# EAGLE design rev_g (EAGLE 7.6.0)
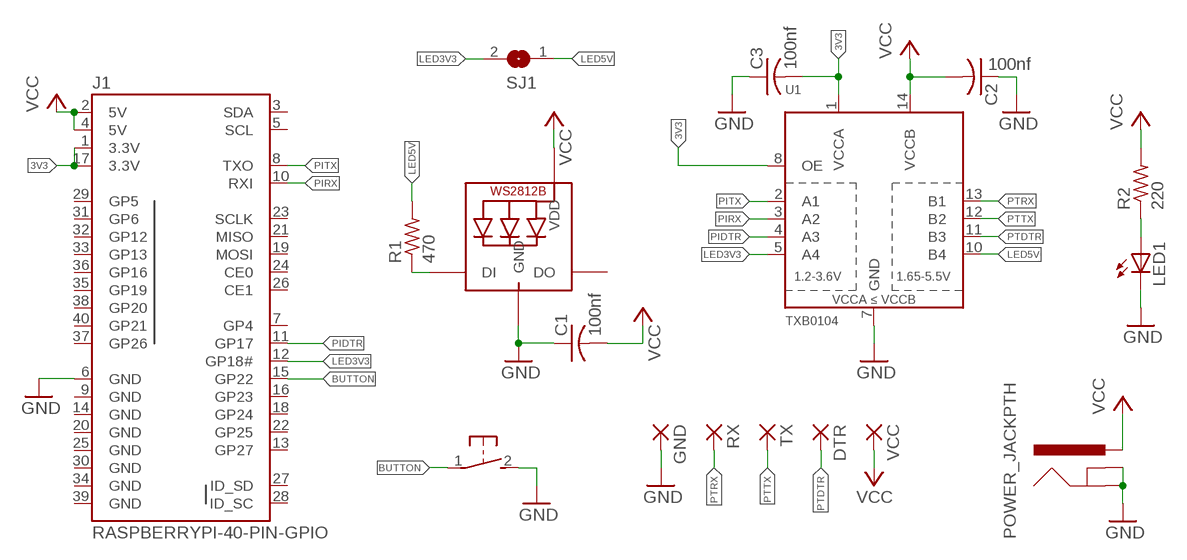
[diagram p0: schematic, sheet 1]

## Parts
C1  100nf  C-USC0805K  [C0805K]
C2  100nf  C-USC0805K  [C0805K]
C3  100nf  C-USC0805K  [C0805K]
DTR  SMD5  [SMD2,54-5,08]
GND  SMD5  [SMD2,54-5,08]
J1  RASPBERRYPI-40-PIN-GPIO  [2X20-SHROUDED]
J3  POWER_JACKPTH  [POWER_JACK_PTH]
LED1  LEDCHIPLED_0805  [CHIPLED_0805]
LED2  WS2812B5050  [WS2812B]
R1  470  R-US_M0805  [M0805]
R2  220  R-US_M0805  [M0805]
RX  SMD5  [SMD2,54-5,08]
S1  DTSM-3  [DTSM-3]
SJ1  SJ  [SJ]
TX  SMD5  [SMD2,54-5,08]
U1  TXB0104  TXB0104PWR  [TSSOP14]
VCC  SMD5  [SMD2,54-5,08]

## Nets
3V3: C3.2 J1.1(3.3V) J1.17(3.3V) U1.1(VCCA) U1.8(OE)
BUTTON: J1.15(GP22) S1.1
GND: C1.1 C2.1 C3.1 GND.1(P) J1.6(GND) J3.GND J3.GNDBREAK LED1.C LED2.3-GND(GND) S1.2 U1.7(GND)
LED3V3: J1.12(GP18#) SJ1.2 U1.5(A4)
LED5V: R1.2 SJ1.1 U1.10(B4)
N$1: LED2.4-DIN(DI) R1.1
N$2: LED1.A R2.1
PIDTR: J1.11(GP17) U1.4(A3)
PIRX: J1.10(RXI) U1.3(A2)
PITX: J1.8(TXO) U1.2(A1)
PTDTR: DTR.1(P) U1.11(B3)
PTRX: RX.1(P) U1.13(B1)
PTTX: TX.1(P) U1.12(B2)
VCC: C1.2 C2.2 J1.2(5V) J1.4(5V) J3.PWR LED2.1-VDD(VDD) R2.2 U1.14(VCCB) VCC.1(P)
Unconnected: J1.3(SDA) J1.5(SCL) J1.7(GP4) J1.13(GP27) J1.16(GP23) J1.18(GP24) J1.19(MOSI) J1.21(MISO) J1.22(GP25) J1.23(SCLK) J1.24(CE0) J1.26(CE1) J1.27(ID_SD) J1.28(ID_SC) J1.29(GP5) J1.31(GP6) J1.32(GP12) J1.33(GP13) J1.35(GP19) J1.36(GP16) J1.37(GP26) J1.38(GP20) J1.40(GP21) LED2.2-DOUT(DO)

## Power pins joined to a net without a drawn wire
GND: J1.9(GND) J1.14(GND) J1.20(GND) J1.25(GND) J1.30(GND) J1.34(GND) J1.39(GND)

## Library data of the parts
C1-C3 = rcl:C-US: CAPACITOR, American symbol
DTR GND RX TX VCC = wirepad:SMD5: SMD PAD
J1 = SparkFun-Boards:RASPBERRYPI-40-PIN-GPIO: Second Generation Raspberry Pi GPIO Header 2x20 pin connector, as found on B, B+, A+ models.
J3 = SparkFun-Connectors:POWER_JACK: Power Jack This is the standard 5.5mm barrel jack for power. The PTH is the most common, proven, reliable, footprint. The Slot footprint only works if the mill layer is transmitted to the PCB fab house so be warned. Mating wall wart : TOL-00298 (and others); PROD_ID: CONN-08197
LED1 = led:LED: LED OSRAM: - CHIPLED LG R971, LG N971, LY N971, LG Q971, LY Q971, LO R971, LY R971 LH N974, LH R974 LS Q976, LO Q976, LY Q976 LO Q996 - Hyper CHIPLED LW Q18S LB Q993, LB Q99A, LB R99A - SideLED LS A670, LO A670, LY A670, LG A670, LP A670 LB A673, LV A673, LT A673, LW A673 LH A674 LY A675 LS A676, LA A676, LO A676, LY A676, LW A676 LS A679, LY A679, LG A679 - Hyper Micro SIDELED® LS Y876, LA Y876, LO Y876, LY Y876 LT Y87S - SmartLED LW L88C, LW L88S LB L89C, LB L89S, LG L890 LS L89K, LO L89K, LY L89K LS L896, LA L896, LO L896, LY L896 - TOPLED LS T670, LO T670, LY T670, LG T670, LP T670 LSG T670, LSP T670, LSY T670, LOP T670, LYG T670 LG T671, LOG T671, LSG T671 LB T673, LV T673, LT T673, LW T673 LH T674 LS T676, LA T676, LO T676, LY T676, LB T676, LH T676, LSB T676, LW T676 LB T67C, LV T67C, LT T67C, LS T67K, LO T67K, LY T67K, LW E67C LS E67B, LA E67B, LO E67B, LY E67B, LB E67C, LV E67C, LT E67C LW T67C LS T679, LY T679, LG T679 LS T770, LO T770, LY T770, LG T770, LP T770 LB T773, LV T773, LT T773, LW T773 LH T774 LS E675, LA E675, LY E675, LS T675 LS T776, LA T776, LO T776, LY T776, LB T776 LHGB T686 LT T68C, LB T68C - Hyper Mini TOPLED® LB M676 - Mini TOPLED Santana® LG M470 LS M47K, LO M47K, LY M47K Source: http://www.osram.convergy.de LUXEON: - LUMILED® LXK2-PW12-R00, LXK2-PW12-S00, LXK2-PW14-U00, LXK2-PW14-V00 LXK2-PM12-R00, LXK2-PM12-S00, LXK2-PM14-U00 LXK2-PE12-Q00, LXK2-PE12-R00, LXK2-PE12-S00, LXK2-PE14-T00, LXK2-PE14-U00 LXK2-PB12-K00, LXK2-PB12-L00, LXK2-PB12-M00, LXK2-PB14-N00, LXK2-PB14-P00, LXK2-PB14-Q00 LXK2-PR12-L00, LXK2-PR12-M00, LXK2-PR14-Q00, LXK2-PR14-R00 LXK2-PD12-Q00, LXK2-PD12-R00, LXK2-PD12-S00 LXK2-PH12-R00, LXK2-PH12-S00 LXK2-PL12-P00, LXK2-PL12-Q00, LXK2-PL12-R00 Source: www.luxeon.com KINGBRIGHT: KA-3528ASYC Source: www.kingbright.com
LED2 = adafruit:WS2812B
R1 R2 = rcl:R-US_: RESISTOR, American symbol
S1 = switch-tact:DTSM-3
SJ1 = jumper:SJ: SMD solder JUMPER
U1 = SparkFun-DigitalIC:TXB0104PWR: 4-Bit Bi-Directional Level Shifter 1.2V-3.6V (VCCA) to 1.65V-5.5V (VCCB) bi-directional level shifter with auto direction sensing. Max data rate - VCCA 1.8V: 20Mbps (50ns), VCCA 3.3V: 100Mbps (10ns) Digikey: 296-21929-1-ND (TSSOP) IC-11329; PROD_ID: IC-11329

## Board
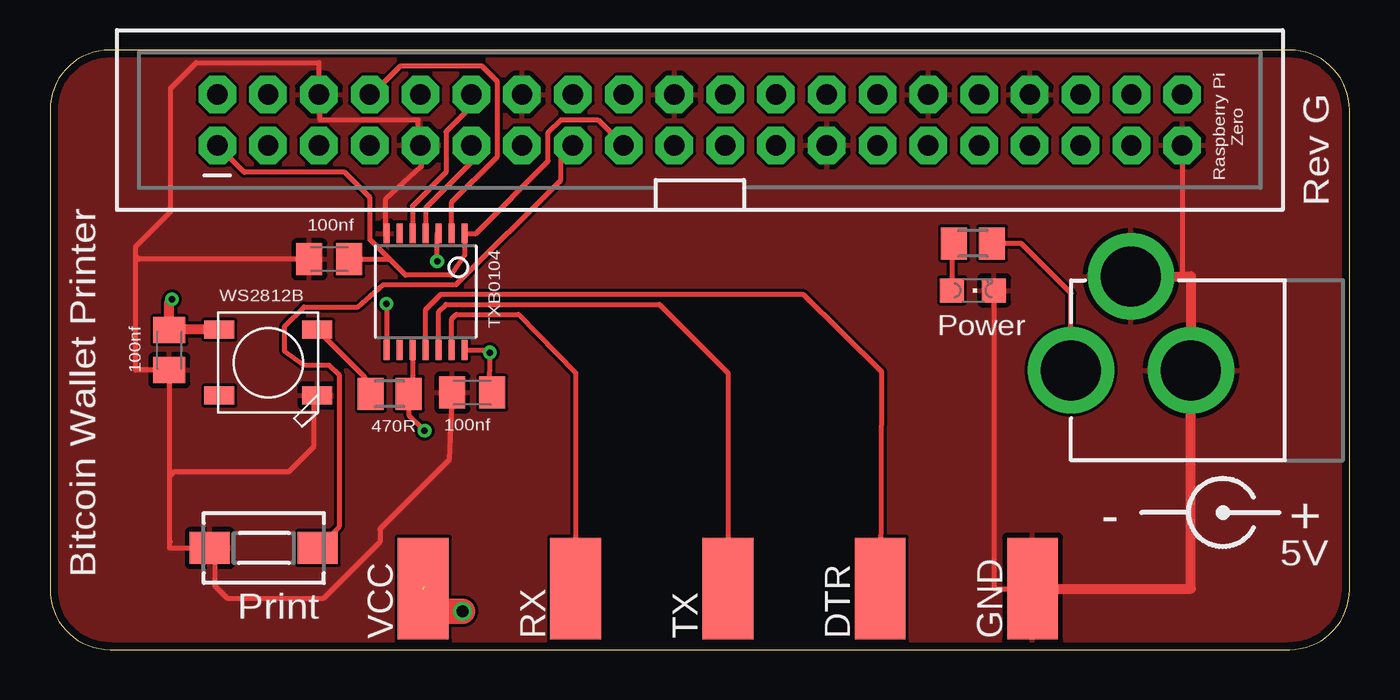
[diagram p1: board, top side]
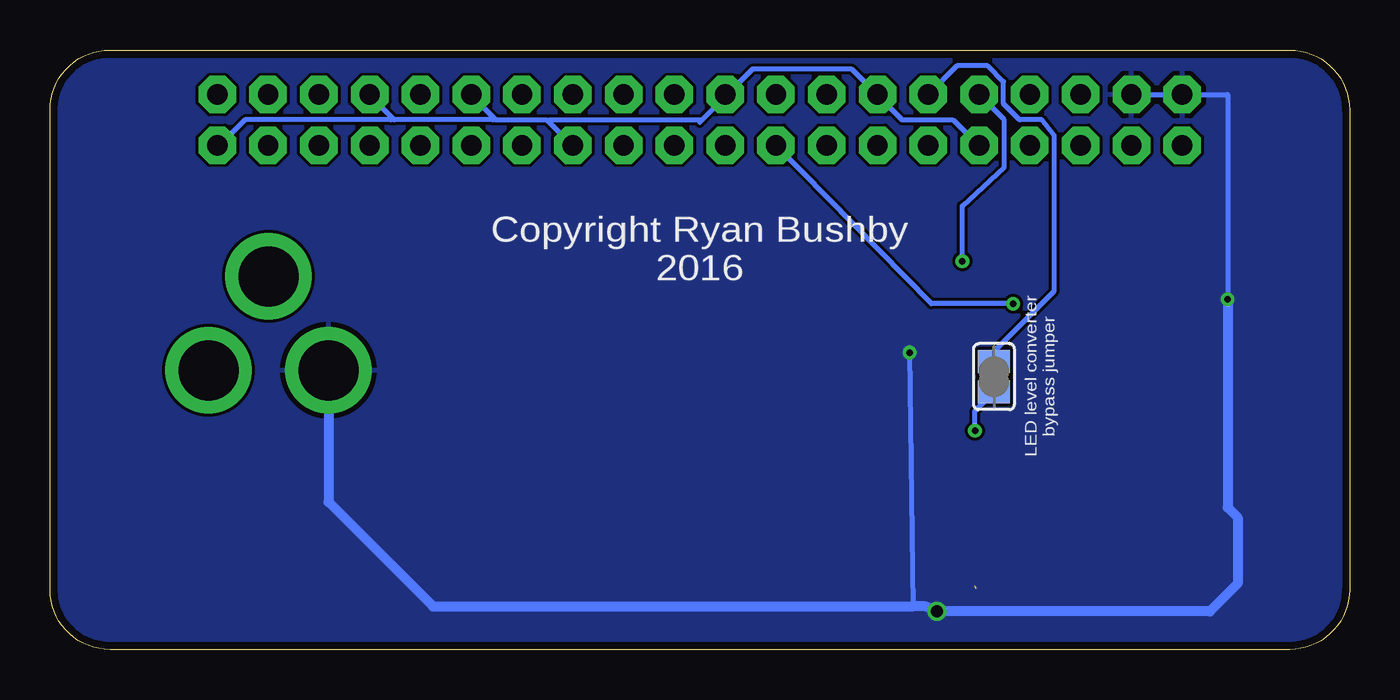
[diagram p2: board, bottom side, seen from below]

Size 65 x 30 mm. Coordinates in mm from the lower left corner, seen from the top.
Outline: 0,27 0,3 arc90 3,0 62,0 arc90 65,3 65,27 arc90 62,30 3,30 arc90 0,27
Copper layers (1*16): Top 0.0356mm / dielectric 1.5011mm / Bottom 0.0356mm
Design rules "LaenPCBOrder *": minimum track width 10mil, minimum drill 13mil, track to track 6mil, track to pad 6mil, pad to pad 6mil, via to via 6mil, smd to smd 6mil, copper to edge 15mil, drill to drill 6mil, minimum pad ring 7mil, minimum via ring 7mil, stop-mask expansion 3mil, vias tented up to drill 100mil, thermal gap 10mil

### Footprints (pad centres in the part's own frame; a part is rotated, then mirrored left to right if it is on the bottom)
C0805K = smd 1.3 x 1.6: 1 -1,0; 2 1,0
SMD2,54-5,08 = smd 2.54 x 5.08: 1 0,0
2X20-SHROUDED = drill 1.016 pad 1.88 octagon: 1 -1.27,24.13; 2 1.27,24.13; 3 -1.27,21.59; 4 1.27,21.59; 5 -1.27,19.05; 6 1.27,19.05; 7 -1.27,16.51; 8 1.27,16.51; 9 -1.27,13.97; 10 1.27,13.97; 11 -1.27,11.43; 12 1.27,11.43; 13 -1.27,8.89; 14 1.27,8.89; 15 -1.27,6.35; 16 1.27,6.35; 17 -1.27,3.81; 18 1.27,3.81; 19 -1.27,1.27; 20 1.27,1.27; 21 -1.27,-1.27; 22 1.27,-1.27; 23 -1.27,-3.81; 24 1.27,-3.81; 25 -1.27,-6.35; 26 1.27,-6.35; 27 -1.27,-8.89; 28 1.27,-8.89; 29 -1.27,-11.43; 30 1.27,-11.43; 31 -1.27,-13.97; 32 1.27,-13.97; 33 -1.27,-16.51; 34 1.27,-16.51; 35 -1.27,-19.05; 36 1.27,-19.05; 37 -1.27,-21.59; 38 1.27,-21.59; 39 -1.27,-24.13; 40 1.27,-24.13
POWER_JACK_PTH = drill 2.997 pad 4.318: GND 0,7.7; GNDBREAK 4.7,10.7; PWR 0,13.7
CHIPLED_0805 = smd 1.2 x 1.2: A 0,-1.05; C 0,1.05
WS2812B = smd 1.5 x 0.9: 1-VDD 2.45,-1.65; 2-DOUT 2.45,1.65; 3-GND -2.45,1.65; 4-DIN -2.45,-1.65
M0805 = smd 1.3 x 1.6: 1 -0.95,0; 2 0.95,0
DTSM-3 = smd 2 x 1.6: 1 -2.7,0; 2 2.7,0
SJ = smd 1.168 x 1.6: 1 -0.762,0; 2 0.762,0
TSSOP14 = smd 0.305 x 0.991: 1 -1.95,-2.918; 2 -1.3,-2.918; 3 -0.65,-2.918; 4 0,-2.918; 5 0.65,-2.918; 6 1.3,-2.918; 7 1.95,-2.918; 8 1.95,2.918; 9 1.3,2.918; 10 0.65,2.918; 11 0,2.918; 12 -0.65,2.918; 13 -1.3,2.918; 14 -1.95,2.918

### Placement (x,y rotation side)
C1  5.97,14.99 90 top
C2  21.11,12.86 0 top
C3  13.97,19.53 0 top
DTR  41.53,3.05 0 top
GND  49.15,3.05 0 top
J1  32.5,26.5 90 top
J3  64.77,13.97 90 top
LED1  46.16,17.97 270 top
LED2  10.92,14.35 180 top
R1  17,12.8 0 top
R2  46.16,20.32 0 top
RX  26.29,3.05 0 top
S1  10.69,5.08 180 top
SJ1  17.78,13.65 90 bottom
TX  33.91,3.05 0 top
U1  18.8,17.91 180 top
VCC  18.67,3.05 0 top

### Tracks (layer width: path | path; a pad name or v marks a point on that pad's centre or on a via)
3V3  (via drill 0.33)
  Top 0.254: 16.99,19.53 17.78,18.73 20.07,18.73 20.75,19.73 U1.1 21.3,20.82 24.92,24.45 24.92,25.88 25.56,26.51 27.41,26.51 J1.17 | 16.99,19.53 16,20.51 16,22.61 14.73,23.88 9.72,23.88 J1.1 | v16.83,17.3 U1.8 | C3.2 16.99,19.53
  Bottom 0.254: v16.83,17.3 20.92,17.3 J1.17
BUTTON
  Top 0.254: S1.1 14.48,6.17 14.48,13.72 13.97,14.22 12.7,14.22 11.75,14.92 11.75,16.19 12.7,17.14 15.4,17.14 16.67,18.26 20.32,18.26 25.56,23.5 25.56,24.64 J1.15 26.15,25.39
GND
  Top 0.254: 5.97,8.64 C1.1 4.29,13.99 4.29,19.68 | 5.97,8.64 5.97,5.4 | 5.97,5.4 5.97,5.08 S1.2 8.26,4.82 8.26,3.17 8.89,2.54 13.65,2.54 16.51,5.4 16.51,6.03 19.95,9.48 C2.1 | 13.34,12.7 LED2.3-GND | 6.03,5.4 5.97,5.4 | LED2.3-GND 13.18,12.38 13.18,10.13 11.94,8.89 6.22,8.89 5.97,8.64 | J1.9 18.41,25.24 18.41,26.51 13.49,26.51 13.49,27.62 J1.6 13.45,29.37 7.3,29.37 6.03,28.1 6.03,21.91 4.29,20.16 4.29,19.68 | 56.67,18.67 56.67,25.08 J1.39 | J1.9 18.57,25.08 18.57,24.16 16.76,22.51 16.76,20.91 U1.7 | 18.73,25.08 J1.9 | 13.34,13.02 LED2.3-GND | LED1.C 47.22,3.05 49.66,3.05 | C3.1 4.45,19.53 4.29,19.68
  Top 0.508: J3.GNDBREAK 56.67,18.67 57.07,18.67 J3.GND 57.07,3.05 49.66,3.05 GND.1
  Bottom 0.254: J1.9 18.57,25.24 19.84,26.51 22.38,26.51 23.5,27.62 J1.14 23.65,27.78 24.92,29.05 29.84,29.05 31.11,27.78 J1.20 31.27,27.62 32.38,26.51 | 40.08,26.43 40.16,26.51 42.7,26.51 42.78,26.59 | 40.08,26.43 38.89,25.24 J1.25 | 42.78,26.59 43.81,27.62 J1.30 | 32.38,26.51 40.01,26.51 40.08,26.43 | 47.86,26.59 47.78,26.51 42.86,26.51 42.78,26.59 | 47.86,26.59 48.9,27.62 J1.34 | J1.39 56.52,25.24 55.24,26.51 47.94,26.51 47.86,26.59 | 32.51,26.38 32.38,26.51
  pour Top: 0,0 0,29.84 0.32,30.16 65.09,30.16 65.09,0.32 64.45,0
LED3V3
  Top 0.254: U1.5 18.13,20.97 18.13,22.19 19.81,23.88 19.81,25.91 21.07,27.17 J1.12
  Bottom 0.254: SJ1.2 17.78,14.92 14.76,17.94 14.76,25.72 15.4,26.51 16.51,26.51 17.3,27.3 17.3,28.42 18.1,29.21 19.63,29.21 J1.12
LED5V  (via drill 0.33)
  Top 0.254: U1.10 18.15,13 R1.2 17.95,11.74 v18.73,10.95
  Bottom 0.254: v18.73,10.95 18.73,11.94 SJ1.1
N$1
  Top 0.254: R1.1 15.73,13.64 LED2.4-DIN
N$2
  Top 0.254: R2.1 45.11,20.32 LED1.A
PIDTR
  Top 0.254: J1.11 21.07,24.37 18.8,22.1 U1.4
PIRX  (via drill 0.33)
  Top 0.254: 19.45,20.46 U1.3 19.37,20.82 v19.37,19.43
  Bottom 0.254: v19.37,19.43 19.37,22.19 17.27,24.13 17.27,26.51 J1.10
PITX
  Top 0.254: J1.8 16.09,27.77 17.53,29.21 21.59,29.21 22.35,28.45 22.35,24.64 20.07,22.35 20.07,21.49 U1.2
PTDTR
  Top 0.254: U1.11 18.8,17.02 19.56,17.78 37.66,17.78 41.59,13.91 DTR.1
PTRX
  Top 0.254: U1.13 20.1,16.54 20.32,16.76 23.43,16.76 26.29,13.84 RX.1
PTTX
  Top 0.254: U1.12 19.45,16.91 19.81,17.27 30.48,17.27 33.91,13.84 TX.1
VCC  (via drill 0.33, 0.6)  (1 unrouted)
  Top 0.254: 8.57,15.88 LED2.1-VDD | U1.14 21.94,14.99 v22,14.86 21.95,13.59 C2.2 | J3.PWR 51.07,17.83 48.58,20.32 R2.2
  Top 0.508: LED2.1-VDD 5.98,16 C1.2 5.97,17.4 v6.1,17.53 | 19.81,1.91 VCC.1
  Top 1.27: 18.67,1.91 18.83,2.06 18.73,3.17 | v20.64,1.91 19.81,1.91
  Bottom 0.254: J1.4 J1.2 6.1,27.77 v6.1,17.53 | v22,14.86 21.84,2.16
  Bottom 0.508: J3.PWR 51.07,7.38 45.85,2.16 21.84,2.16 21.21,2.16 v20.64,1.91 6.99,1.91 5.59,3.3 5.59,6.6 6.1,7.11 v6.1,17.53
  pour Bottom: 0,0 0,29.84 0.32,30.16 65.09,30.16 65.09,0.32 64.77,0

### Text on the board
tPlace: Rev G | Raspberry Pi / Zero | 100nf | TXB0104 | WS2812B | Power | 100nf | 470R | 100nf | - | + | 5V | Bitcoin Wallet Printer | Print
bPlace: Copyright Ryan Bushby / 2016 | LED level converter / bypass jumper